# Altium schematic sheet MicroSD.SchDoc
size A; SheetNumber: 4; SheetTotal: 8
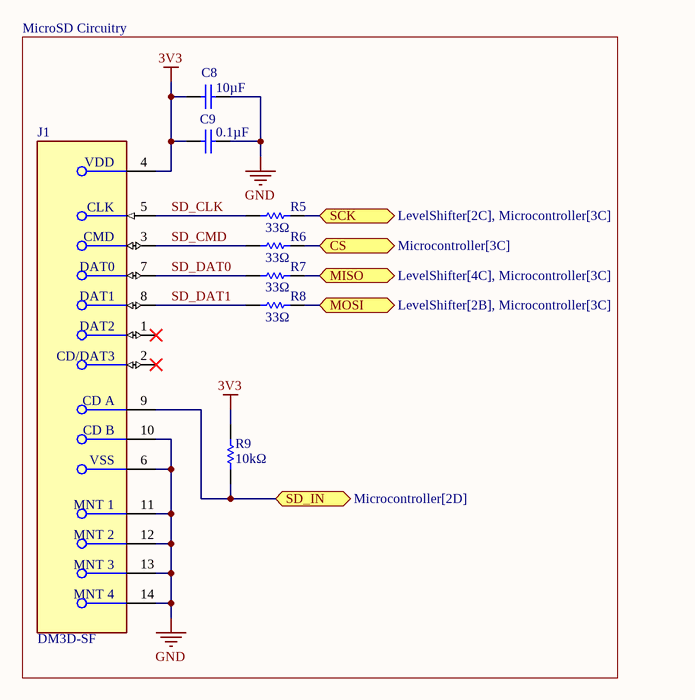
[diagram p0: MicroSD.SchDoc]

## Parts
C8  10µF  [CAPC3216X180X50ML20T25]
C9  0.1µF  [CAPC3216X100X50ML20T25]
J1  DM3D-SF  [FP-DM3D-SF-MFG]
R5  33Ω  [RESC1206(3216)_L]
R6  33Ω  [RESC1206(3216)_L]
R7  33Ω  [RESC1206(3216)_L]
R8  33Ω  [RESC1206(3216)_L]
R9  10kΩ  [RESC3116X65X40LL10T20]

## Blocks framed on the sheet
MicroSD Circuitry: C8 C9 J1 R5-R9

## Ports
CS (bidir, see Microcontroller[3C]), MISO (bidir, see LevelShifter[4C], Microcontroller[3C]), MOSI (bidir, see LevelShifter[2B], Microcontroller[3C]), SCK (bidir, see LevelShifter[2C], Microcontroller[3C]), SD_IN (bidir, see Microcontroller[2D])

## Nets
3V3: C8.2 C9.2 J1.4(VDD) R9.2
GND: C8.1 C9.1 J1.6(VSS) J1.10(CD_B) J1.11(MNT_1) J1.12(MNT_2) J1.13(MNT_3) J1.14(MNT_4)
CS: R6.2 ; port CS
MISO: R7.2 ; port MISO
MOSI: R8.2 ; port MOSI
SCK: R5.2 ; port SCK
SD_CLK: J1.5(CLK) R5.1
SD_CMD: J1.3(CMD) R6.1
SD_DAT0: J1.7(DAT0) R7.1
SD_DAT1: J1.8(DAT1) R8.1
SD_IN: J1.9(CD_A) R9.1 ; port SD_IN

Not connected (* = marked no-connect by the designer): J1 1(DAT2)* 2(CD/DAT3)*

## Library data of the parts
C8 = CMP-1664-00006-1: CAP, Ceramic, 10 uF, +/- 10%, 16 V, -55 to 125 degC, 1206 (3216 Metric), RoHS, Tape and Reel; Voltage Rating: 50 V; Case\Package: 0603; Type (Capacitors): C0G; Tolerance: 5%; Capacitance: 8.2 pF; Length: 1.6 mm; Mount: Surface Mount; Radiation Hardening: No; Height: 0.8 mm; RoHSCompliant: true; ComponentLink1URL: http://www.kemet.com/; REACH SVHC: No SVHC; ComponentLink1Description: Manufacturer URL; ComponentLink2Description: Datasheet; ComponentLink2URL: http://capacitoredge.kemet.com/capedge2/DataSheet/Datasheet-C1206C106K4RACTU.pdf?pn=C1206C106K4RACTU; Width: 0.8 mm; Packaging: Tape and Reel; Min Operating Temperature: -55 degC; Voltage Rating (DC): 50 V; Pins: 2; Max Operating Temperature: 125 degC; Case Code (Imperial): 0603; PackageDescription: 2-Pin Surface Mount Device, Body 3.2 x 1.6 mm; DatasheetVersion: Aug-16; Package Quantity: 4000; PackageReference: 1206; Case Code (Metric): 1608
C9 = CMP-1664-00001-4: Chip Capacitor, 100 nF, +/- 10%, 25 V, -55 to 125 degC, 1206 (3216 Metric), RoHS, Tape and Reel; Manufacturer: Kemet; Voltage Rating: 25 V; ComponentLink1URL: http://www.kemet.com/; Max Operating Temperature: 125 degC; PackageReference: 1206; ComponentLink2URL: http://www.kemet.com/docfinder?Partnumber=C1206F104K3RACTU; ComponentLink1Description: Manufacturer URL; ComponentLink2Description: Datasheet; Length: 3.2 mm; Packaging: Tape and Reel; Height: 0.78 mm; Mounting Technology: Surface Mount; REACH SVHC: No SVHC; PackageDescription: 2-Pin Surface Mount Device, Body 3.2 x 1.6 mm; Min Operating Temperature: -55 degC; RoHSCompliant: true; DatasheetVersion: 02/2016; Package Quantity: 4000
J1 = CMP-2000-06166-2: CONN MICRO SD CARD PUSH-PULL; Insulation Resistance: 1GR; Max Voltage Rating (AC): 125V; Gender: Female; Contact Resistance: 100mR; Current Rating: 500mA; Pitch: 1.1mm; Connector Type: Connector; Number of Contacts: 8; Contact Plating: Gold; Number of Rows: 1; Termination: Solder; Contact Material: Copper Alloy; REACH SVHC: No SVHC; Voltage Rating (AC): 125V; Packaging: Tape and Reel; Housing Material: Polymer; Max Operating Temperature: 85°C; Package Quantity: 1; Min Operating Temperature: -25°C; Lead Free: Lead Free; Orientation: Right Angle; Radiation Hardening: No; Flammability Rating: UL94 V-0; Mount: Surface Mount; Depth: 11.45mm; Max Current Rating: 500mA; Length: 11.95mm; Width: 11.95mm
R5-R8 = CMP-1014-00341-1: 33R 0.25W 1% 1206 (3216 Metric)  SMD; Case-EIA: 1206; Value: 33.00 Ohm; Case-Metric: 3216; Tolerance: 1 %; Technology: SMT; Power: 0.25 W
R9 = CMP-1014-00623-2: Chip Resistor, 10 KOhm, +/- 1%, 0.25 W, -55 to 155 degC, 1206 (3216 Metric), RoHS, Tape and Reel; Manufacturer: Yageo; Voltage Rating: 200V; Resistance: 10KOhm; Temperature Coefficient: 100ppm/degreesC; Power Rating: 250mW; Packaging: TapeandReel; Termination: SMD/SMT; REACH SVHC: Unknown; Tolerance: 1%; Height: 0.55mm; Composition: ThickFilm; Max Operating Temperature: 155degC; Datasheet Version: Rev. 5, 10/2016; Lead Free: LeadFree; Case Code (Metric): 3216; Depth: 1.6mm; Package Quantity: 5000; RoHSCompliant: true; Military Standard: Not; Case/Package: 1206; Case Code (Imperial): 1206; Min Operating Temperature: -55degC; Datasheet URL: http://www.yageo.com/NewPortal/yageodocoutput?fileName=/pdf/R-Chip/PYu-RC_Group_51_RoHS_L_5.pdf; Length: 3.1mm; Manufacturer URL: http://www.yageo.com/; Package Reference: 1206.0; Width: 1.6mm; Package Description: 2-Pin Surface Mount Device, Body 3.1 x 1.6 mm